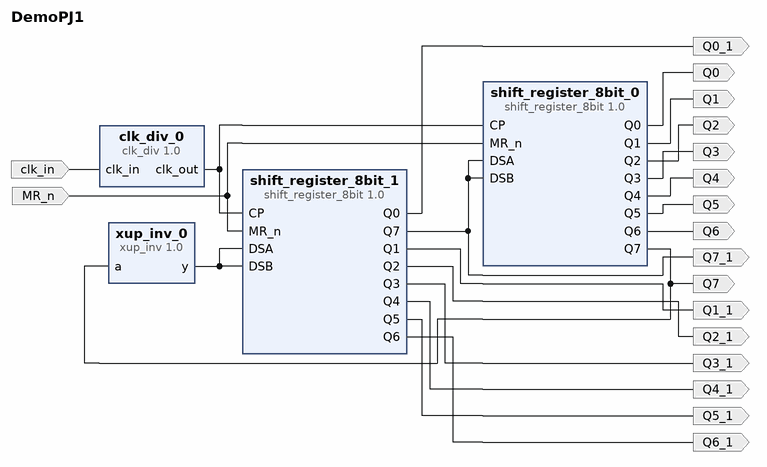
[diagram p0: block diagram of the top level]
# Vivado block design DemoPJ1, Vivado 2015.3
create_bd_design DemoPJ1

create_bd_port -dir I clk_in
create_bd_port -dir O Q7
create_bd_port -dir O Q6
create_bd_port -dir O Q5
create_bd_port -dir O Q4
create_bd_port -dir O Q3
create_bd_port -dir O Q2
create_bd_port -dir O Q1
create_bd_port -dir O Q0
create_bd_port -dir O Q7_1
create_bd_port -dir O Q6_1
create_bd_port -dir O Q5_1
create_bd_port -dir O Q4_1
create_bd_port -dir O Q3_1
create_bd_port -dir O Q2_1
create_bd_port -dir O Q1_1
create_bd_port -dir I MR_n
create_bd_port -dir O Q0_1

create_bd_cell -type ip -vlnv xilinx.com:xup:shift_register_8bit:1.0 shift_register_8bit_1
create_bd_cell -type ip -vlnv xilinx.com:xup:clk_div:1.0 clk_div_0
set_property -dict {CONFIG.N 99999999} [get_bd_cells clk_div_0]
create_bd_cell -type ip -vlnv xilinx.com:xup:shift_register_8bit:1.0 shift_register_8bit_0
create_bd_cell -type ip -vlnv xilinx.com:xup:xup_inv:1.0 xup_inv_0

# ---- connections ----

connect_bd_net -net xup_nand2_0_y [get_bd_pins xup_inv_0/y] [get_bd_pins shift_register_8bit_1/DSA] [get_bd_pins shift_register_8bit_1/DSB]
connect_bd_net [get_bd_pins clk_div_0/clk_out] [get_bd_pins shift_register_8bit_1/CP] [get_bd_pins shift_register_8bit_0/CP]
connect_bd_net [get_bd_pins shift_register_8bit_1/Q7] \
  [get_bd_pins shift_register_8bit_0/DSA] [get_bd_pins shift_register_8bit_0/DSB] [get_bd_ports Q7_1]
connect_bd_net [get_bd_pins shift_register_8bit_1/Q0] [get_bd_ports Q0_1]
connect_bd_net [get_bd_pins shift_register_8bit_0/Q7] [get_bd_ports Q7] [get_bd_pins xup_inv_0/a]
connect_bd_net [get_bd_ports clk_in] [get_bd_pins clk_div_0/clk_in]
connect_bd_net [get_bd_pins shift_register_8bit_0/Q6] [get_bd_ports Q6]
connect_bd_net [get_bd_pins shift_register_8bit_0/Q5] [get_bd_ports Q5]
connect_bd_net [get_bd_pins shift_register_8bit_0/Q4] [get_bd_ports Q4]
connect_bd_net [get_bd_pins shift_register_8bit_0/Q3] [get_bd_ports Q3]
connect_bd_net [get_bd_pins shift_register_8bit_0/Q2] [get_bd_ports Q2]
connect_bd_net [get_bd_pins shift_register_8bit_0/Q1] [get_bd_ports Q1]
connect_bd_net [get_bd_pins shift_register_8bit_0/Q0] [get_bd_ports Q0]
connect_bd_net [get_bd_pins shift_register_8bit_1/Q6] [get_bd_ports Q6_1]
connect_bd_net [get_bd_pins shift_register_8bit_1/Q5] [get_bd_ports Q5_1]
connect_bd_net [get_bd_pins shift_register_8bit_1/Q4] [get_bd_ports Q4_1]
connect_bd_net [get_bd_pins shift_register_8bit_1/Q3] [get_bd_ports Q3_1]
connect_bd_net [get_bd_pins shift_register_8bit_1/Q2] [get_bd_ports Q2_1]
connect_bd_net [get_bd_pins shift_register_8bit_1/Q1] [get_bd_ports Q1_1]
connect_bd_net [get_bd_ports MR_n] [get_bd_pins shift_register_8bit_1/MR_n] [get_bd_pins shift_register_8bit_0/MR_n]

validate_bd_design
save_bd_design
